# Altium schematic sheet DCtoAC Schematic.SchDoc
size A; SheetNumber: 1; SheetTotal: 4; SPICEModelCacheUNANASZX: <root> / <DocumentId>UNANASZX</DocumentId> / </root>
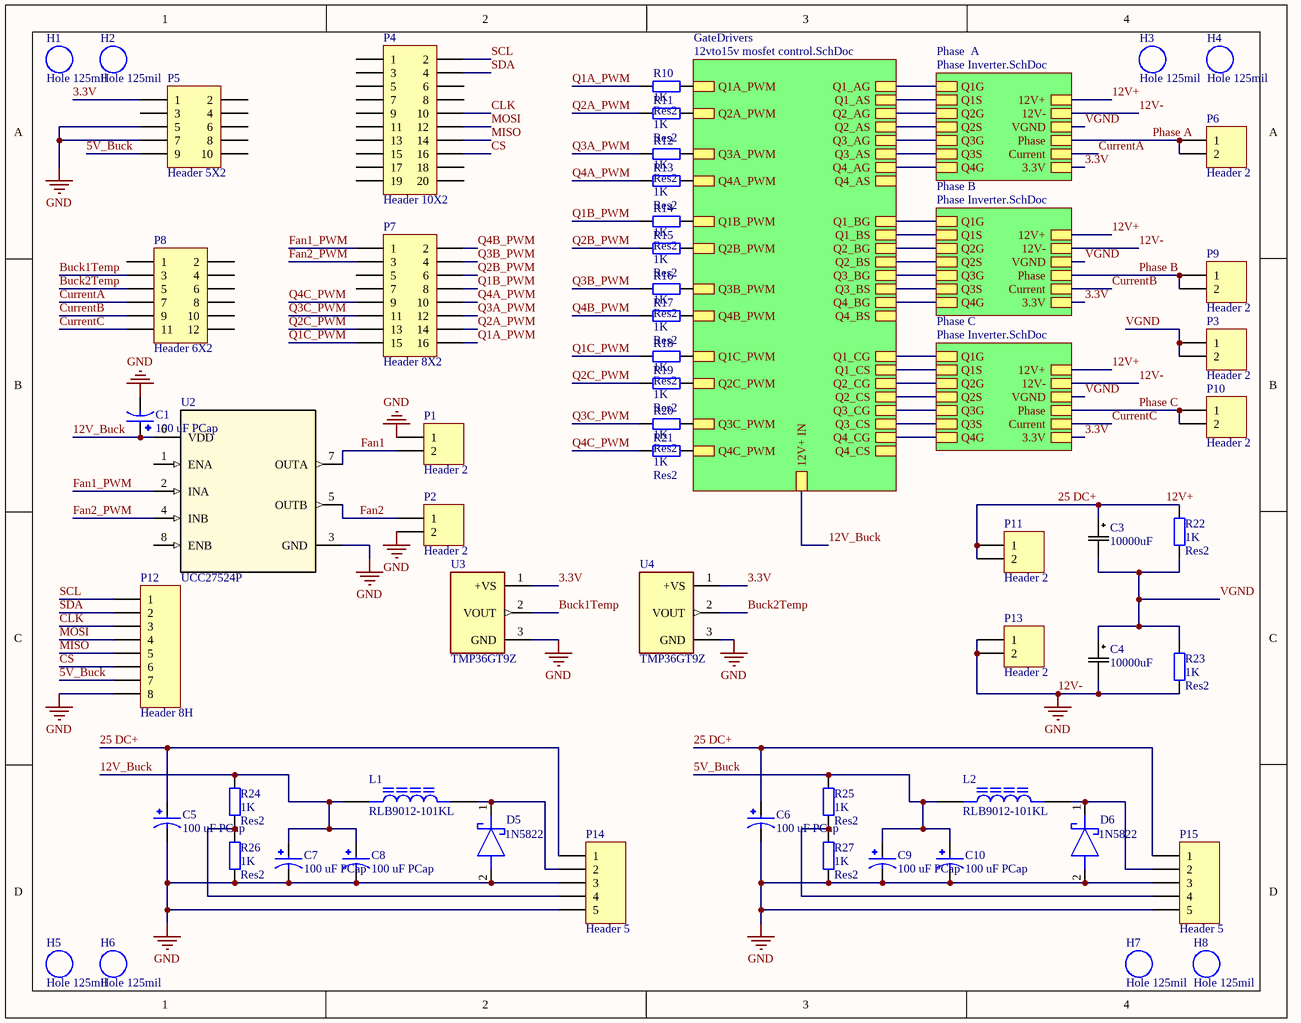
[diagram p0: DCtoAC Schematic.SchDoc]

## Parts
C1  100 uF PCap  [100uF PCap]
C3  10000uF  [CAP_UBY_18X35P5_NCH]
C4  10000uF  [CAP_UBY_18X35P5_NCH]
C5  100 uF PCap  [100uF PCap]
C6  100 uF PCap  [100uF PCap]
C7  100 uF PCap  [100uF PCap]
C8  100 uF PCap  [100uF PCap]
C9  100 uF PCap  [100uF PCap]
C10  100 uF PCap  [100uF PCap]
D5  1N5822  [DIOAD3070W130L950D530]
D6  1N5822  [DIOAD3070W130L950D530]
H1  Hole 125mil  [Hole 125mil]
H2  Hole 125mil  [Hole 125mil]
H3  Hole 125mil  [Hole 125mil]
H4  Hole 125mil  [Hole 125mil]
H5  Hole 125mil  [Hole 125mil]
H6  Hole 125mil  [Hole 125mil]
H7  Hole 125mil  [Hole 125mil]
H8  Hole 125mil  [Hole 125mil]
L1  RLB9012-101KL  [IND_RLB9012-101KL]
L2  RLB9012-101KL  [IND_RLB9012-101KL]
P1  Header 2  [HDR1X2]
P2  Header 2  [HDR1X2]
P3  Header 2  [HDR1X2]
P4  Header 10X2  [HDR2X10]
P5  Header 5X2  [HDR2X5]
P6  Header 2  [HDR1X2]
P7  Header 8X2  [HDR2X8]
P8  Header 6X2  [HDR2X6]
P9  Header 2  [HDR1X2]
P10  Header 2  [HDR1X2]
P11  Header 2  [HDR1X2]
P12  Header 8H  [HDR1X8H]
P13  Header 2  [HDR1X2]
P14  Header 5  [HDR1X5]
P15  Header 5  [HDR1X5]
R10  Res2  value 1K  [AXIAL-0.4]
R11  Res2  value 1K  [AXIAL-0.4]
R12  Res2  value 1K  [AXIAL-0.4]
R13  Res2  value 1K  [AXIAL-0.4]
R14  Res2  value 1K  [AXIAL-0.4]
R15  Res2  value 1K  [AXIAL-0.4]
R16  Res2  value 1K  [AXIAL-0.4]
R17  Res2  value 1K  [AXIAL-0.4]
R18  Res2  value 1K  [AXIAL-0.4]
R19  Res2  value 1K  [AXIAL-0.4]
R20  Res2  value 1K  [AXIAL-0.4]
R21  Res2  value 1K  [AXIAL-0.4]
R22  Res2  value 1K  [AXIAL-0.4]
R23  Res2  value 1K  [AXIAL-0.4]
R24  Res2  value 1K  [AXIAL-0.4]
R25  Res2  value 1K  [AXIAL-0.4]
R26  Res2  value 1K  [AXIAL-0.4]
R27  Res2  value 1K  [AXIAL-0.4]
U2  UCC27524P  [P0008A]
U3  TMP36GT9Z  [TO92127P521H733-3]
U4  TMP36GT9Z  [TO92127P521H733-3]

## Sub-sheets
GateDrivers = 12vto15v mosfet control.SchDoc: Q1A_PWM, Q1_AG, Q1_AS, Q2A_PWM, Q2_AG, Q2_AS, Q3A_PWM, Q3_AG, Q3_AS, Q4A_PWM, Q4_AG, Q4_AS, Q1B_PWM, Q1_BG, Q1_BS, Q2B_PWM, Q2_BG, Q2_BS, Q3B_PWM, Q3_BG, Q3_BS, Q4B_PWM, Q4_BG, Q4_BS, Q1C_PWM, Q1_CG, Q1_CS, Q2C_PWM, Q2_CG, Q2_CS, Q3C_PWM, Q3_CG, Q3_CS, Q4C_PWM, Q4_CG, Q4_CS, 12V+ IN
Phase  A = Phase Inverter.SchDoc: Q1G, Q2G, Q3G, 12V+, Q1S, Q3S, 12V-, Q4G, Q2S, Phase, VGND, 3.3V, Current
Phase B = Phase Inverter.SchDoc: Q1G, Q2G, Q3G, 12V+, Q1S, Q3S, 12V-, Q4G, Q2S, Phase, VGND, Current, 3.3V
Phase C = Phase Inverter.SchDoc: Q1G, Q2G, Q3G, 12V+, Q1S, Q3S, 12V-, Q4G, Q2S, Phase, VGND, Current, 3.3V

## Nets
12V-: C1.N C4.2 C5.N C6.N C7.N C8.N C9.N C10.N D5.2(A) D6.2(A) P1.1 P2.2 P5.5 P5.7 P12.8 P13.1 P13.2 P14.3 P14.5 P15.3 P15.5 R23.1 R26.2 R27.2 U2.3(GND) U3.3(GND) U4.3(GND) ; sheet Phase  A/12V-, sheet Phase B/12V-, sheet Phase C/12V-  [also labelled GND]
3.3V: P5.1 U3.1(+VS) U4.1(+VS) ; sheet Phase  A/3.3V, sheet Phase B/3.3V, sheet Phase C/3.3V
5V_Buck: C9.P C10.P L2.1 P5.9 P12.7 R25.1
12V+: C3.1 C5.P C6.P P11.1 P11.2 P14.1 P15.1 R22.2 ; sheet Phase  A/12V+, sheet Phase B/12V+, sheet Phase C/12V+  [also labelled 25 DC+]
12V_Buck: C1.P C7.P C8.P L1.1 R24.1 U2.6(VDD) ; sheet GateDrivers/12V+ IN
Buck1Temp: P8.3 U3.2(VOUT)
Buck2Temp: P8.5 U4.2(VOUT)
CLK: P4.10 P12.3
CS: P4.16 P12.6
CurrentA: P8.7 ; sheet Phase  A/Current
CurrentB: P8.9 ; sheet Phase B/Current
CurrentC: P8.11 ; sheet Phase C/Current
Fan1: P1.2 U2.7(OUTA)
Fan1_PWM: P7.1 U2.2(INA)
Fan2: P2.1 U2.5(OUTB)
Fan2_PWM: P7.3 U2.4(INB)
MISO: P4.14 P12.5
MOSI: P4.12 P12.4
Phase A: P6.1 P6.2 ; sheet Phase  A/Phase
Phase B: P9.1 P9.2 ; sheet Phase B/Phase
Phase C: P10.1 P10.2 ; sheet Phase C/Phase
Q1A_PWM: P7.16 R10.1
Q1B_PWM: P7.8 R14.1
Q1C_PWM: P7.15 R18.1
Q2A_PWM: P7.14 R11.1
Q2B_PWM: P7.6 R15.1
Q2C_PWM: P7.13 R19.1
Q3A_PWM: P7.12 R12.1
Q3B_PWM: P7.4 R16.1
Q3C_PWM: P7.11 R20.1
Q4A_PWM: P7.10 R13.1
Q4B_PWM: P7.2 R17.1
Q4C_PWM: P7.9 R21.1
SCL: P4.2 P12.1
SDA: P4.4 P12.2
VGND: C3.2 C4.1 P3.1 P3.2 R22.1 R23.2 ; sheet Phase  A/VGND, sheet Phase B/VGND, sheet Phase C/VGND
NetD5_1: D5.1(K) L1.2 P14.2
NetD6_1: D6.1(K) L2.2 P15.2
NetP14_4: P14.4 R24.2 R26.1
NetP15_4: P15.4 R25.2 R27.1
NetR10_2: R10.2 ; sheet GateDrivers/Q1A_PWM
NetR11_2: R11.2 ; sheet GateDrivers/Q2A_PWM
NetR12_2: R12.2 ; sheet GateDrivers/Q3A_PWM
NetR13_2: R13.2 ; sheet GateDrivers/Q4A_PWM
NetR14_2: R14.2 ; sheet GateDrivers/Q1B_PWM
NetR15_2: R15.2 ; sheet GateDrivers/Q2B_PWM
NetR16_2: R16.2 ; sheet GateDrivers/Q3B_PWM
NetR17_2: R17.2 ; sheet GateDrivers/Q4B_PWM
NetR18_2: R18.2 ; sheet GateDrivers/Q1C_PWM
NetR19_2: R19.2 ; sheet GateDrivers/Q2C_PWM
NetR20_2: R20.2 ; sheet GateDrivers/Q3C_PWM
NetR21_2: R21.2 ; sheet GateDrivers/Q4C_PWM
(unnamed): sheet GateDrivers/Q1_AG, sheet Phase  A/Q1G
(unnamed): sheet GateDrivers/Q1_AS, sheet Phase  A/Q1S
(unnamed): sheet GateDrivers/Q2_AG, sheet Phase  A/Q2G
(unnamed): sheet GateDrivers/Q2_AS, sheet Phase  A/Q2S
(unnamed): sheet GateDrivers/Q3_AG, sheet Phase  A/Q3G
(unnamed): sheet GateDrivers/Q3_AS, sheet Phase  A/Q3S
(unnamed): sheet GateDrivers/Q4_AG, sheet Phase  A/Q4G
(unnamed): sheet GateDrivers/Q1_BG, sheet Phase B/Q1G
(unnamed): sheet GateDrivers/Q1_BS, sheet Phase B/Q1S
(unnamed): sheet GateDrivers/Q2_BG, sheet Phase B/Q2G
(unnamed): sheet GateDrivers/Q2_BS, sheet Phase B/Q2S
(unnamed): sheet GateDrivers/Q3_BG, sheet Phase B/Q3G
(unnamed): sheet GateDrivers/Q3_BS, sheet Phase B/Q3S
(unnamed): sheet GateDrivers/Q4_BG, sheet Phase B/Q4G
(unnamed): sheet GateDrivers/Q1_CG, sheet Phase C/Q1G
(unnamed): sheet GateDrivers/Q1_CS, sheet Phase C/Q1S
(unnamed): sheet GateDrivers/Q2_CG, sheet Phase C/Q2G
(unnamed): sheet GateDrivers/Q2_CS, sheet Phase C/Q2S
(unnamed): sheet GateDrivers/Q3_CG, sheet Phase C/Q3G
(unnamed): sheet GateDrivers/Q3_CS, sheet Phase C/Q3S
(unnamed): sheet GateDrivers/Q4_CG, sheet Phase C/Q4G

Not connected (* = marked no-connect by the designer): P4 1 3 5 6 7 8 9 11 13 15 17 18 19 20; P5 2 3 4 6 8 10; P7 5 7; P8 1 2 4 6 8 10 12; U2 1(ENA) 8(ENB)

## Library data of the parts
C1 C5-C10 = 100 uF PCap: Capacitor; Aluminum Electrolytic; Radial Al Electrolytic Cap; 100uF 63V; MF: Panasonic Electronic; MP: EEU-FC1J101; Package: RADIAL-2 Panasonic; Price: None; Check_prices: https://www.snapeda.com/parts/EEU-FC1J101/Panasonic%20Electronic%20Components/view-part/494707/?ref=eda; Value: *; SnapEDA_Link: https://www.snapeda.com/parts/EEU-FC1J101/Panasonic%20Electronic%20Components/view-part/494707/?ref=snap; Availability: In Stock
C3 C4 = 10000uF: No Description Available; Mfr_Name: Nichicon
D5 D6 = 1N5822: Schottky Diode; Manufacturer_Name: STMicroelectronics; Datasheet Link: http://www.st.com/web/en/resource/technical/document/datasheet/CD00001626.pdf; Manufacturer_Part_Number: 1N5822; Mouser Part Number: 511-1N5822; Mouser Price/Stock: https://www.mouser.co.uk/ProductDetail/STMicroelectronics/1N5822?qs=JV7lzlMm3yJ50hlrGV6%252BnQ%3D%3D; Arrow Part Number: 1N5822; Arrow Price/Stock: https://www.arrow.com/en/products/1n5822/stmicroelectronics?utm_currency=USD&region=nac
P1-P3 P6 P9-P11 P13 = Header 2: Header, 2-Pin; LatestRevisionDate: 17-Jul-2002; LatestRevisionNote: Re-released for DXP Platform.; Publisher: Altium Limited
P4 = Header 10X2: Header, 10-Pin, Dual row; LatestRevisionDate: 17-Jul-2002; LatestRevisionNote: Re-released for DXP Platform.; Publisher: Altium Limited
P5 = Header 5X2: Header, 5-Pin, Dual row; LatestRevisionDate: 17-Jul-2002; LatestRevisionNote: Re-released for DXP Platform.; Publisher: Altium Limited
P7 = Header 8X2: Header, 8-Pin, Dual row; LatestRevisionDate: 17-Jul-2002; LatestRevisionNote: Re-released for DXP Platform.; Publisher: Altium Limited
P8 = Header 6X2: Header, 6-Pin, Dual row; LatestRevisionDate: 17-Jul-2002; LatestRevisionNote: Re-released for DXP Platform.; Publisher: Altium Limited
P12 = Header 8H: Header, 8-Pin, Right Angle; LatestRevisionDate: 17-Jul-2002; LatestRevisionNote: Re-released for DXP Platform.; Publisher: Altium Limited
P14 P15 = Header 5: Header, 5-Pin; LatestRevisionDate: 17-Jul-2002; LatestRevisionNote: Re-released for DXP Platform.; Publisher: Altium Limited
R10-R27 = Res2: Resistor; Published: 8-Jun-2000; LatestRevisionDate: 17-Jul-2002; LatestRevisionNote: Re-released for DXP Platform.; PackageReference: AXIAL-0.4; Publisher: Altium Limited; PackageDescription: Axial Device, Thru-Hole; 2 Leads; 0.4 in Pin Spacing
U2 = UCC27524P: IC Gate; Mfr_Name: Texas Instruments; TYPE: TYPE; RefDes: RefDes
U3 U4 = TMP36GT9Z: Voltage Output Temperature Sensors; MF: Analog Devices; Check_prices: https://www.snapeda.com/parts/TMP36GT9Z/Analog+Devices/view-part/?ref=eda; Price: None; MP: TMP36GT9Z; SnapEDA_Link: https://www.snapeda.com/parts/TMP36GT9Z/Analog+Devices/view-part/?ref=snap; Availability: In Stock; Value: *; Purchase-URL: https://pricing.snapeda.com/search/part/TMP36GT9Z/?ref=eda; Package: TO-3 Analog Devices
L1 L2 = RLB9012-101KL: Value: *; Package: None; Price: None; Availability: Unavailable; MP: RLB9012-101KL